# EAGLE design microphone (EAGLE 9.6.2)
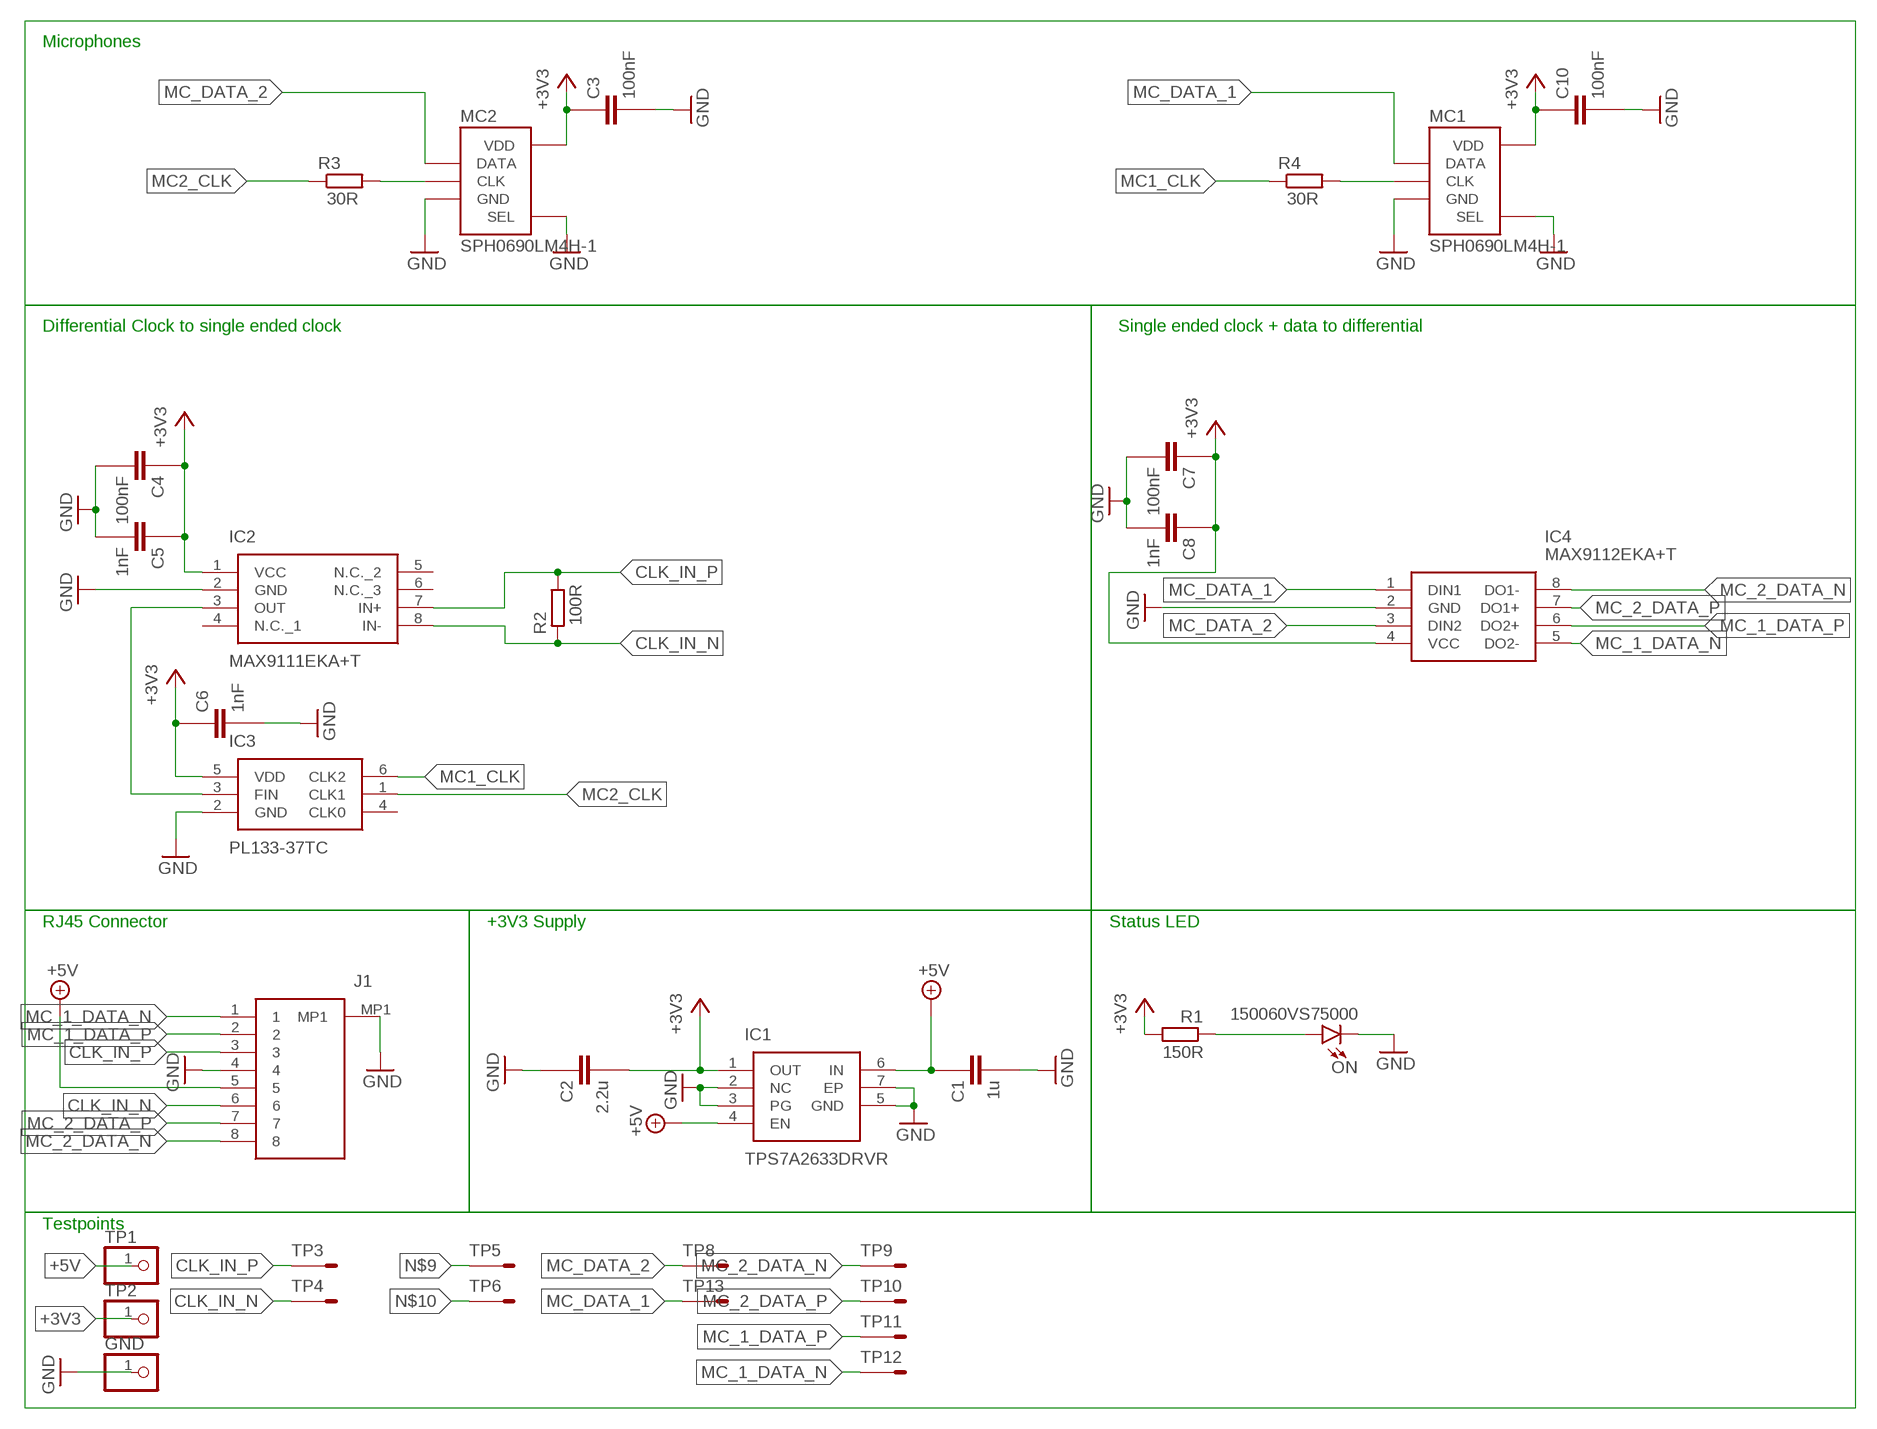
[diagram p0: schematic, sheet 1]

## Parts
C1  1u  LMK107B7105KA-T  [CAPC1608X90N]
C2  2.2u  GRM188R71A225KE15D  [CAPC1608X90N]
C3  100nF  885012205037  [CAPC1005X55N]
C4  100nF  885012205037  [CAPC1005X55N]
C5  1nF  0402YC102JAT2A  [CAPC1005X56N]
C6  1nF  0402YC102JAT2A  [CAPC1005X56N]
C7  100nF  885012205037  [CAPC1005X55N]
C8  1nF  0402YC102JAT2A  [CAPC1005X56N]
C10  100nF  885012205037  [CAPC1005X55N]
GND  PINHD-1X1  [1X01]
IC1  TPS7A2633DRVR  [TPS7A2633DRVR]
IC2  MAX9111EKA+T  [SOT65P280X145-8N]
IC3  PL133-37TC  [SOT95P280X135-6N]
IC4  MAX9112EKA+T  [SOT65P280X145-8N]
J1  RJE231883116T  [RJE231883116T]
MC1  SPH0690LM4H-1  [SPH0690LM4H-1]
MC2  SPH0690LM4H-1  [SPH0690LM4H-1]
ON  150060VS75000  [LEDC1608X80N]
R1  150  ERJ-2RKF1500X  [RESC1005X40N]
R2  RT0402FRE07100RL  [RESC1005X8N]
R3  100nF  RC0402FR-1330RL  [RESC1005X40N]
R4  100nF  RC0402FR-1330RL  [RESC1005X40N]
TP1  PINHD-1X1  [1X01]
TP2  PINHD-1X1  [1X01]
TP3  TESTPOINT_05_05  [TP_05_05]
TP4  TESTPOINT_05_05  [TP_05_05]
TP5  TESTPOINT_05_05  [TP_05_05]
TP6  TESTPOINT_05_05  [TP_05_05]
TP8  TESTPOINT_05_05  [TP_05_05]
TP9  TESTPOINT_05_05  [TP_05_05]
TP10  TESTPOINT_05_05  [TP_05_05]
TP11  TESTPOINT_05_05  [TP_05_05]
TP12  TESTPOINT_05_05  [TP_05_05]
TP13  TESTPOINT_05_05  [TP_05_05]

## Nets
+3V3: C2.2 C3.1 C4.1 C5.1 C6.1 C7.1 C8.1 C10.1 IC1.1(OUT) IC2.1(VCC) IC3.5(VDD) IC4.4(VCC) MC1.VDD MC2.VDD R1.1 TP2.1
+5V: C1.1 IC1.4(EN) IC1.6(IN) J1.5 TP1.1
CLK_IN_N [CLK_IN_DIFF]: IC2.8(IN-) J1.6 R2.1 TP4.TP
CLK_IN_P [CLK_IN_DIFF]: IC2.7(IN+) J1.3 R2.2 TP3.TP
GND: C1.2 C2.1 C3.2 C4.2 C5.2 C6.2 C7.2 C8.2 C10.2 GND.1 IC1.2(NC) IC1.3(PG) IC1.5(GND) IC1.7(EP) IC2.2(GND) IC3.2(GND) IC4.2(GND) J1.4 J1.MP1 MC1.GND MC1.SEL MC2.GND MC2.SEL ON.1(K)
MC1_CLK: IC3.6(CLK2) R4.1
MC2_CLK: IC3.1(CLK1) R3.1
MC_1_DATA_N: IC4.5(DO2-) J1.1 TP12.TP
MC_1_DATA_P: IC4.6(DO2+) J1.2 TP11.TP
MC_2_DATA_N: IC4.8(DO1-) J1.8 TP9.TP
MC_2_DATA_P: IC4.7(DO1+) J1.7 TP10.TP
MC_DATA_1: IC4.1(DIN1) MC1.DATA TP13.TP
MC_DATA_2: IC4.3(DIN2) MC2.DATA TP8.TP
N$2: ON.2(A) R1.2
N$3: IC2.3(OUT) IC3.3(FIN)
N$9: MC2.CLK R3.2 TP5.TP
N$10: MC1.CLK R4.2 TP6.TP
Unconnected: IC2.4(N.C._1) IC2.5(N.C._2) IC2.6(N.C._3) IC3.4(CLK0)

## Notes on the sheet
- Microphones
- Differential Clock to single ended clock | Single ended clock + data to differential
- RJ45 Connector | +3V3 Supply | Status LED
- Testpoints

## Library data of the parts
C1 = SamacSys_Parts:LMK107B7105KA-T: Taiyo Yuden LMK107B7105KA-T 1uF Multilayer Ceramic Capacitor MLCC 10V dc +/-10% Tolerance SMD Source: Datasheet <http://uk.rs-online.com/web/p/products/1721466>; DESCRIPTION: Taiyo Yuden LMK107B7105KA-T 1uF Multilayer Ceramic Capacitor MLCC 10V dc +/-10% Tolerance SMD; HEIGHT: 0.9mm; MANUFACTURER_NAME: TAIYO YUDEN; MANUFACTURER_PART_NUMBER: LMK107B7105KA-T; MOUSER_PART_NUMBER: 963-LMK107B7105KA-T; MOUSER_PRICE-STOCK: https://www.mouser.com/Search/Refine.aspx?Keyword=963-LMK107B7105KA-T; RS_PART_NUMBER: 1721466P; RS_PRICE-STOCK: http://uk.rs-online.com/web/p/products/1721466P
C2 = SamacSys_Parts:GRM188R71A225KE15D: Ceramic SMT capacitor 2.2uF 10Vdc Murata 0603 GRM 2.2??F Ceramic Multilayer Capacitor, 10 V dc, +125??C, X7R Dielectric, ??10% Source: Datasheet <https://psearch.en.murata.com/capacitor/product/GRM188R71A225KE15#.html>; DESCRIPTION: Ceramic SMT capacitor 2.2uF 10Vdc Murata 0603 GRM 2.2??F Ceramic Multilayer Capacitor, 10 V dc, +125??C, X7R Dielectric, ??10%; HEIGHT: 0.9mm; MANUFACTURER_NAME: Murata Electronics; MANUFACTURER_PART_NUMBER: GRM188R71A225KE15D; MOUSER_PART_NUMBER: 81-GRM188R71A225KE15; MOUSER_PRICE-STOCK: https://www.mouser.com/Search/Refine.aspx?Keyword=81-GRM188R71A225KE15; RS_PART_NUMBER: 7235597P; RS_PRICE-STOCK: http://uk.rs-online.com/web/p/products/7235597P
C3 C4 C7 C10 = SamacSys_Parts:885012205037: Wurth Elektronik 100nF Multilayer Ceramic Capacitor MLCC 16V dc +/-10% X7R Dielectric 0402 (1005M) SMD Source: Datasheet <https://katalog.we-online.com/pbs/datasheet/885012205037.pdf>; DESCRIPTION: Wurth Elektronik 100nF Multilayer Ceramic Capacitor MLCC 16V dc +/-10% X7R Dielectric 0402 (1005M) SMD; HEIGHT: 0.55mm; MANUFACTURER_NAME: Wurth Elektronik; MANUFACTURER_PART_NUMBER: 885012205037; MOUSER_PART_NUMBER: 710-885012205037; MOUSER_PRICE-STOCK: https://www.mouser.com/Search/Refine.aspx?Keyword=710-885012205037; RS_PART_NUMBER: 8391528P; RS_PRICE-STOCK: http://uk.rs-online.com/web/p/products/8391528P
C5 C6 C8 = SamacSys_Parts:0402YC102JAT2A: AVX - 0402YC102JAT2A - CAP, MLCC, X7R, 1NF, 16V, 0402 Source: Datasheet <http://www.mouser.com/catalog/supplier/library/pdf/AVXSurfaceMountCeramic.pdf>; DESCRIPTION: AVX - 0402YC102JAT2A - CAP, MLCC, X7R, 1NF, 16V, 0402; HEIGHT: 0.56mm; MANUFACTURER_NAME: AVX; MANUFACTURER_PART_NUMBER: 0402YC102JAT2A; MOUSER_PART_NUMBER: 581-0402YC102JAT2A; MOUSER_PRICE-STOCK: https://www.mouser.com/Search/Refine.aspx?Keyword=581-0402YC102JAT2A; RS_PART_NUMBER: 1364217; RS_PRICE-STOCK: http://uk.rs-online.com/web/p/products/1364217
GND TP1 TP2 = pinhead:PINHD-1X1: PIN HEADER
IC1 = SamacSys_Parts:TPS7A2633DRVR: 18-V, Ultra-Low IQ, Low-Dropout Linear Voltage Regulator Source: Datasheet <https://www.ti.com/lit/gpn/TPS7A26>; DESCRIPTION: 18-V, Ultra-Low IQ, Low-Dropout Linear Voltage Regulator; HEIGHT: 0.8mm; MANUFACTURER_NAME: Texas Instruments; MANUFACTURER_PART_NUMBER: TPS7A2633DRVR; MOUSER_PART_NUMBER: 595-TPS7A2633DRVR; MOUSER_PRICE-STOCK: https://www.mouser.com/Search/Refine.aspx?Keyword=595-TPS7A2633DRVR
IC2 = SamacSys_Parts:MAX9111EKA+T: MAXIM INTEGRATED PRODUCTS - MAX9111EKA+T - LVDS RECEIVER, 500MBPS, 3.6V, SOT23-8 Source: Datasheet <https://datasheets.maximintegrated.com/en/ds/MAX9111-MAX9113.pdf>; DESCRIPTION: MAXIM INTEGRATED PRODUCTS - MAX9111EKA+T - LVDS RECEIVER, 500MBPS, 3.6V, SOT23-8; HEIGHT: 1.45mm; MANUFACTURER_NAME: Maxim Integrated; MANUFACTURER_PART_NUMBER: MAX9111EKA+T; MOUSER_PART_NUMBER: 700-MAX9111EKAT; MOUSER_PRICE-STOCK: https://www.mouser.com/Search/Refine.aspx?Keyword=700-MAX9111EKAT; RS_PART_NUMBER: 1907337; RS_PRICE-STOCK: http://uk.rs-online.com/web/p/products/1907337
IC3 = SamacSys_Parts:PL133-37TC: IC CLK BUFFER 1:3 150MHZ 6SOT23 Source: Datasheet <http://www.microchip.com/mymicrochip/filehandler.aspx?ddocname=en580976>; DESCRIPTION: IC CLK BUFFER 1:3 150MHZ 6SOT23; HEIGHT: 1.35mm; MANUFACTURER_NAME: Microchip; MANUFACTURER_PART_NUMBER: PL133-37TC; MOUSER_PART_NUMBER: 998-PL133-37TC; MOUSER_PRICE-STOCK: https://www.mouser.com/Search/Refine.aspx?Keyword=998-PL133-37TC; RS_PART_NUMBER: 1779647; RS_PRICE-STOCK: http://uk.rs-online.com/web/p/products/1779647
IC4 = SamacSys_Parts:MAX9112EKA+T: LVDS Interface IC Dual LVDS Line Driver Source: Datasheet <https://datasheets.maximintegrated.com/en/ds/MAX9110-MAX9112.pdf>; DESCRIPTION: LVDS Interface IC Dual LVDS Line Driver; HEIGHT: 1.45mm; MANUFACTURER_NAME: Maxim Integrated; MANUFACTURER_PART_NUMBER: MAX9112EKA+T; MOUSER_PART_NUMBER: 700-MAX9112EKAT; MOUSER_PRICE-STOCK: https://www.mouser.com/Search/Refine.aspx?Keyword=700-MAX9112EKAT
J1 = SamacSys_Parts:RJE231883116T: Modular Connectors / Ethernet Connectors RJ 1Port MODJK Con 8P8C ShldwTabs SrfMt Source: Datasheet <https://componentsearchengine.com/Datasheets/1/RJE231883116T.pdf>; ARROW_PART_NUMBER: RJE231883116T; DESCRIPTION: Modular Connectors / Ethernet Connectors RJ 1Port MODJK Con 8P8C ShldwTabs SrfMt; HEIGHT: 13.35mm; MANUFACTURER_NAME: Amphenol; MANUFACTURER_PART_NUMBER: RJE231883116T; MOUSER_PART_NUMBER: 523-RJE231883116T; MOUSER_PRICE-STOCK: https://www.mouser.co.uk/ProductDetail/Amphenol-Commercial-Products/RJE231883116T?qs=F5EMLAvA7IAcLUWKIAtvNw%3D%3D
MC1 MC2 = SPH0690LM4H-1:SPH0690LM4H-1: Knowles SPH0690LM4H-1 MEMS microphone bottom port
ON = SamacSys_Parts:150060VS75000: LED,Wurth Elektronik,150060VS75000 Wurth Elektronik 150060VS75000, WL-SMCW Series Green LED, 570 nm, 1608 (0603) Clear, Rectangle Lens SMD Package Source: Datasheet <http://docs-emea.rs-online.com/webdocs/1302/0900766b81302e1e.pdf>; DESCRIPTION: LED,Wurth Elektronik,150060VS75000 Wurth Elektronik 150060VS75000, WL-SMCW Series Green LED, 570 nm, 1608 (0603) Clear, Rectangle Lens SMD Package; HEIGHT: 0.8mm; MANUFACTURER_NAME: Wurth Elektronik; MANUFACTURER_PART_NUMBER: 150060VS75000; MOUSER_PART_NUMBER: 710-150060VS75000; MOUSER_PRICE-STOCK: https://www.mouser.com/Search/Refine.aspx?Keyword=710-150060VS75000; RS_PART_NUMBER: 8154215P; RS_PRICE-STOCK: http://uk.rs-online.com/web/p/products/8154215P
R1 = SamacSys_Parts:ERJ-2RKF1500X: RESISTOR, 0402 150 Ohm +/- 1 % 0.1 W Source: Datasheet <https://industrial.panasonic.com/cdbs/www-data/pdf/RDA0000/AOA0000C86.pdf>; ALLIED_NUMBER: 70265442; ALLIED_PRICE-STOCK: https://www.alliedelec.com/panasonic-erj-2rkf1500x/70265442/; DESCRIPTION: RESISTOR, 0402 150 Ohm +/- 1 % 0.1 W; HEIGHT: 0.4mm; MANUFACTURER_NAME: Panasonic; MANUFACTURER_PART_NUMBER: ERJ-2RKF1500X; MOUSER_PART_NUMBER: 667-ERJ-2RKF1500X; MOUSER_PRICE-STOCK: https://www.mouser.com/Search/Refine.aspx?Keyword=667-ERJ-2RKF1500X
R2 = RT0402FRE07100RL:RT0402FRE07100RL: Res Thin Film 0402 100 Ohm 1% 0.063W(1/16W) +/-50ppm/C Epoxy Pad SMD T/R Source: Datasheet <https://www.arrow.com/en/products/rt0402fre07100rl/yageo>; DESCRIPTION: Res Thin Film 0402 100 Ohm 1% 0.063W(1/16W) +/-50ppm/C Epoxy Pad SMD T/R; HEIGHT: 0.08mm; MANUFACTURER_NAME: YAGEO (PHYCOMP); MANUFACTURER_PART_NUMBER: RT0402FRE07100RL
R3 R4 = SamacSys_Parts:RC0402FR-1330RL: RESISTOR, 0402 30 Ohms +/-1% 1/16 W Source: Datasheet <https://www.mouser.de/datasheet/2/447/PYu_RC_Group_51_RoHS_L_10-1664068.pdf>; DESCRIPTION: RESISTOR, 0402 30 Ohms +/-1% 1/16 W; HEIGHT: 0.4mm; MANUFACTURER_NAME: YAGEO (PHYCOMP); MANUFACTURER_PART_NUMBER: RC0402FR-1330RL; MOUSER_PART_NUMBER: 603-RC0402FR-1330RL; MOUSER_PRICE-STOCK: https://www.mouser.com/Search/Refine.aspx?Keyword=603-RC0402FR-1330RL
TP3-TP6 TP8-TP13 = test_points:TESTPOINT_05_05

## Board
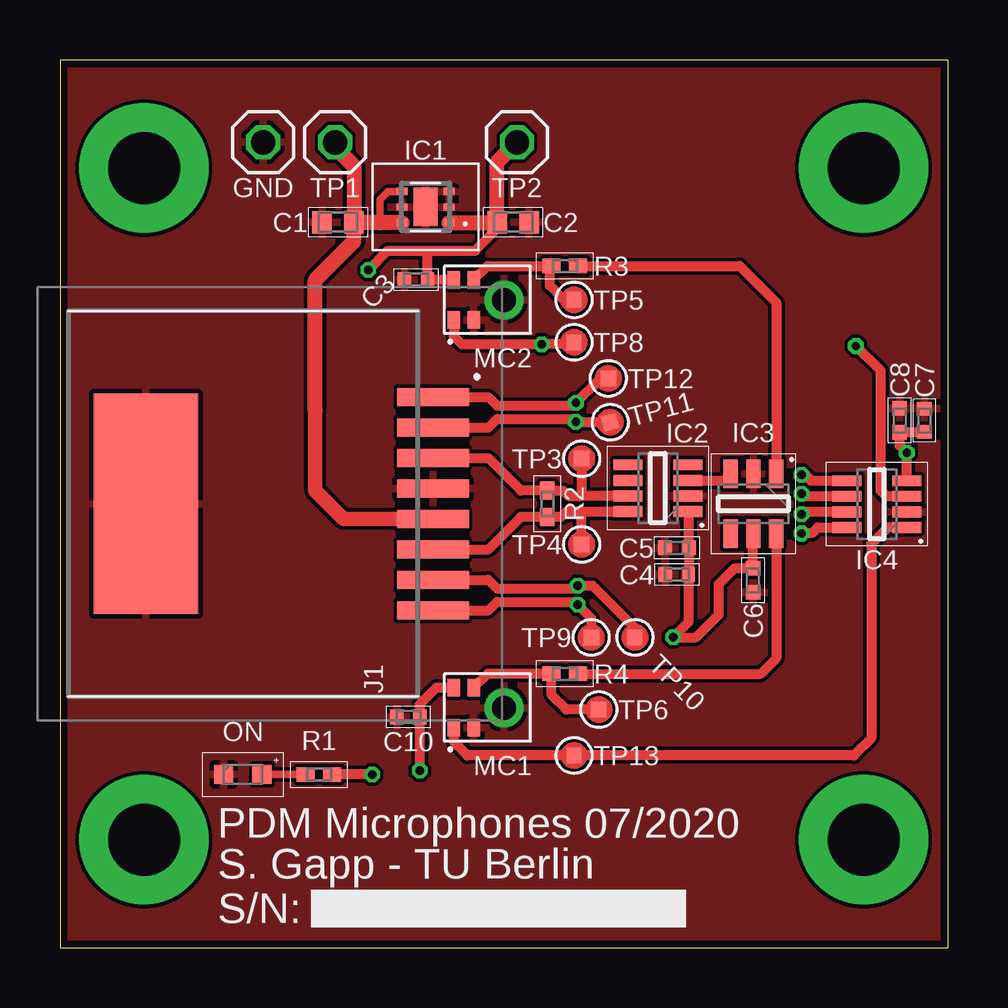
[diagram p1: board, top side]
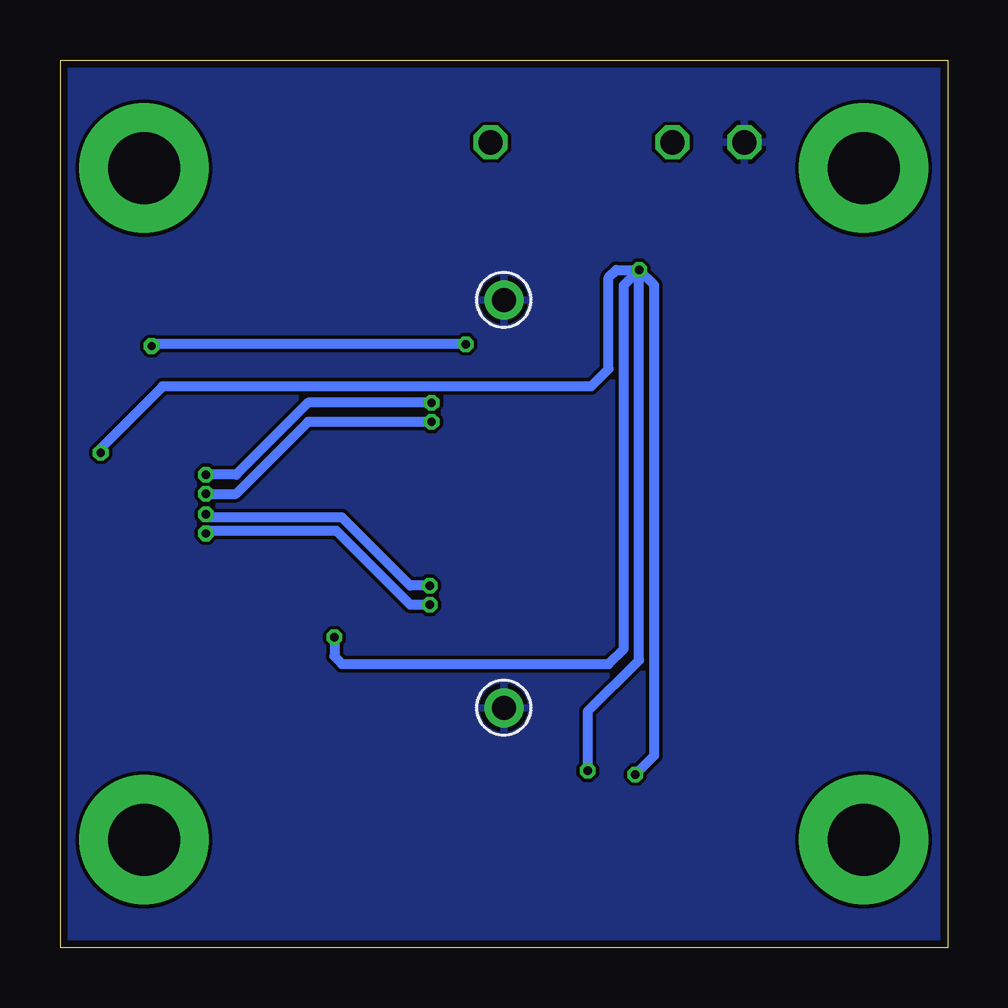
[diagram p2: board, bottom side, seen from below]

Size 37 x 37 mm. Coordinates in mm from the lower left corner, seen from the top.
Outline: 0,0 37,0 37,37 0,37 0,0
Copper layers (1*16): Top 0.035mm / dielectric 1.5mm / Bottom 0.035mm
Design rules "PCB-POOL Standard *": minimum track width 0.15mm, minimum drill 0.3mm, track to track 0.15mm, track to pad 0.15mm, pad to pad 0.15mm, via to via 0.15mm, smd to smd 0.15mm, copper to edge 0.3mm, drill to drill 0.2mm, minimum pad ring 0.2mm, minimum via ring 0.15mm, stop-mask expansion 0.03mm, vias tented up to drill 0mil, thermal gap 0.2mm

### Footprints (pad centres in the part's own frame; a part is rotated, then mirrored left to right if it is on the bottom)
CAPC1608X90N = smd 0.81 x 0.94: 1 -0.67,0; 2 0.67,0
CAPC1005X55N = smd 0.56 x 0.62: 1 -0.48,0; 2 0.48,0
CAPC1005X56N = smd 0.6 x 0.6: 1 -0.5,0; 2 0.5,0
1X01 = drill 1.016 octagon: 1 0,0
TPS7A2633DRVR = smd 0.45 x 0.3: 1 -0.975,0.65; 2 -0.975,0; 3 -0.975,-0.65; 4 0.975,-0.65; 5 0.975,0; 6 0.975,0.65 | smd 1 x 1.6: 7 0,0
SOT65P280X145-8N = smd 1.2 x 0.45: 1 -1.25,0.975; 2 -1.25,0.325; 3 -1.25,-0.325; 4 -1.25,-0.975; 5 1.25,-0.975; 6 1.25,-0.325; 7 1.25,0.325; 8 1.25,0.975
SOT95P280X135-6N = smd 1.2 x 0.6: 1 -1.25,0.95; 2 -1.25,0; 3 -1.25,-0.95; 4 1.25,-0.95; 5 1.25,0; 6 1.25,0.95
RJE231883116T = smd 0.76 x 3: 1 4.445,-6.8; 2 3.175,-6.8; 3 1.905,-6.8; 4 0.635,-6.8; 5 -0.635,-6.8; 6 -1.905,-6.8; 7 -3.175,-6.8; 8 -4.445,-6.8 | smd 9.2 x 4.34: MP1 0,5.17
SPH0690LM4H-1 = smd 0.725 x 0.522: CLK 0.838,1.252; DATA -0.838,2.074; SEL -0.838,1.252; VDD 0.838,2.074 | drill 1 pad 1.625: GND 0,0
LEDC1608X80N = smd 0.8 x 0.8: 1 -0.8,0; 2 0.8,0
RESC1005X40N = smd 0.75 x 0.6: 1 -0.55,0; 2 0.55,0
RESC1005X8N = smd 0.75 x 0.6: 1 -0.55,0; 2 0.55,0
TP_05_05 = smd 0.635 x 0.635: TP 0,0

### Placement (x,y rotation side)
C1  11.59,30.23 180 top
C2  18.89,30.23 180 top
C3  14.84,27.85 180 top
C4  25.72,15.55 180 top
C5  25.72,16.66 180 top
C6  28.89,15.31 270 top
C7  36.04,21.98 90 top
C8  35,21.98 90 top
C10  14.53,9.61 180 top
GND  8.47,33.57 0 top
IC1  15.24,30.87 180 top
IC2  24.92,19.15 180 top
IC3  28.91,18.5 270 top
IC4  34.05,18.49 180 top
J1  8.75,18.5 90 top
MC1  18.5,10 90 top
MC2  18.5,27 90 top
ON  7.62,7.21 0 top
R1  10.79,7.21 180 top
R2  20.32,18.5 90 top
R3  21.04,28.41 180 top
R4  21.04,11.41 180 top
TP1  11.47,33.57 0 top
TP2  19.05,33.57 0 top
TP3  21.75,20.38 180 top
TP4  21.75,16.81 180 top
TP5  21.43,27 180 top
TP6  22.46,9.92 180 top
TP8  21.43,25.23 90 top
TP9  22.15,12.93 180 top
TP10  23.97,12.93 0 top
TP11  22.94,21.9 15 top
TP12  22.86,23.73 0 top
TP13  21.43,8.01 0 top

### Tracks (layer width: path | path; a pad name or v marks a point on that pad's centre or on a via)
+3V3  (via drill 0.35)
  Top 0.406: v13.02,7.21 R1.1 | 15.24,29.04 13.65,29.04 v12.86,28.25 | 15.24,29.04 17.3,29.04 18.22,29.96 C2.2 | MC2.VDD 16.41,27.85 C3.1 15.32,28.96 15.24,29.04 | IC4.4 v35.3,20.63 35,20.93 C8.1 35.02,21.5 C7.1 | IC2.1 26.22,18.13 C5.1 26.22,15.57 C4.1 26.2,13.57 v25.56,12.93 26.51,12.93 27.46,13.88 27.46,15.15 28.12,15.81 C6.1 28.89,17.24 IC3.5 | MC1.VDD 15.69,10.84 15.01,10.16 C10.1 v15,7.37
  Top 0.635: IC1.1 18.21,30.22 C2.2 18.22,32.74 TP2.1
  Bottom 0.406: v13.02,7.21 12.22,8.01 12.22,27.61 v12.86,28.25 | v25.56,12.93 25.56,12.14 25.24,11.82 14.13,11.82 13.49,12.45 13.49,27.61 v12.86,28.25 | v15,7.37 15,9.83 12.86,11.98 v12.86,28.25 | v12.86,28.25 13.81,28.25 14.13,27.93 14.13,24.12 14.86,23.39 32.72,23.39 35.3,20.81 v35.3,20.63
+5V
  Top 0.305: 13.34,30.22 13.34,31.19 13.67,31.52 IC1.4
  Top 0.61: J1.5 11.81,17.86 10.64,19.04 10.64,22.38
  Top 0.635: IC1.6 13.34,30.22 12.24,30.22 12.22,30.2 12.26,30.16 12.26,29.44 10.64,27.82 10.64,22.38 | TP1.1 11.47,33.37 12.26,32.58 C1.1
  Top 0.711: 12.22,30.2 C1.1
CLK_IN_N
  Top 0.406: 21.83,18.17 21.11,18.17 20.89,17.95 R2.1 19.22,17.95 17.86,16.59 J1.6 | 21.83,18.17 IC2.8 | TP4.TP 21.75,18.1 21.83,18.17
CLK_IN_P
  Top 0.406: IC2.7 21.75,18.82 | 21.75,18.82 21.19,18.82 20.97,19.05 R2.2 19.22,19.05 17.86,20.4 J1.3 | TP3.TP 21.75,18.82
GND
  pour Top: 0,37 0,0 37.33,0 37.33,37
  pour Bottom: 0,37 37.15,37 37.15,0 0,0
MC1_CLK
  Top 0.406: IC3.6 29.86,12.06 29.21,11.41 R4.1
MC2_CLK
  Top 0.406: R3.1 28.34,28.41 29.86,26.89 IC3.1
MC_1_DATA_N  (via drill 0.35)
  Top 0.406: TP12.TP 22.53,23.72 v21.51,22.71 21.39,22.59 18.22,22.59 17.86,22.94 J1.1 | IC4.5 31.32,19.46 31.07,19.71 v30.91,19.71
  Bottom 0.406: v30.91,19.71 29.65,19.71 26.65,22.71 v21.51,22.71
MC_1_DATA_P  (via drill 0.35)
  Top 0.406: TP11.TP 22.93,21.91 v21.51,21.91 21.39,22.03 18.22,22.03 17.86,21.67 J1.2 | IC4.6 31.01,18.81 v30.91,18.91
  Bottom 0.406: v30.91,18.91 29.66,18.91 26.67,21.91 v21.51,21.91
MC_2_DATA_N  (via drill 0.35)
  Top 0.406: TP9.TP 22.15,13.73 v21.59,14.29 21.47,14.41 18.22,14.41 17.86,14.05 J1.8 | IC4.8 31.59,17.51 31.34,17.26 v30.91,17.26
  Bottom 0.406: v21.59,14.29 22.39,14.29 25.47,17.37 30.78,17.37 30.79,17.38 v30.91,17.26
MC_2_DATA_P  (via drill 0.35)
  Top 0.406: TP10.TP 23.97,13.33 22.21,15.09 v21.59,15.09 21.47,14.97 18.22,14.97 17.86,15.32 J1.7 | IC4.7 31.01,18.16 v30.91,18.06
  Bottom 0.406: v21.59,15.09 22.4,15.09 25.24,17.93 28.18,17.93 28.19,17.94 30.79,17.94 v30.91,18.06
MC_DATA_1
  Top 0.406: MC1.DATA 16.43,8.56 16.99,8.01 TP13.TP 33.1,8.01 33.81,8.72 33.81,16.82 34.51,17.51 IC4.1
MC_DATA_2  (via drill 0.35)
  Top 0.406: MC2.DATA 16.43,25.48 16.75,25.15 v20.08,25.15 21.35,25.15 TP8.TP | IC4.3 34.44,18.81 34.21,19.04 34.21,24.04 v33.18,25.07
  Bottom 0.406: v33.18,25.07 33.1,25.15 v20.08,25.15
N$2
  Top 0.305: ON.2 R1.2
N$3
  Top 0.406: IC2.3 27.68,19.47 IC3.3
N$5  (via drill 3 pad 5)
  other vias: 33.5,4.49
N$6  (via drill 3 pad 5)
  other vias: 33.5,32.49
N$7  (via drill 3 pad 5)
  other vias: 3.5,4.49
N$8  (via drill 3 pad 5)
  other vias: 3.5,32.49
N$9
  Top 0.406: MC2.CLK 17.82,28.41 R3.2 20.43,28.34 20.43,27.59 21.01,27 TP5.TP
N$10
  Top 0.406: MC1.CLK 17.82,11.41 R4.2 20.5,10.53 21.11,9.92 TP6.TP

### Text on the board
tNames: PDM Microphones 07/2020 | S. Gapp - TU Berlin | S/N: